# EAGLE design RNG01 (EAGLE 6.4)
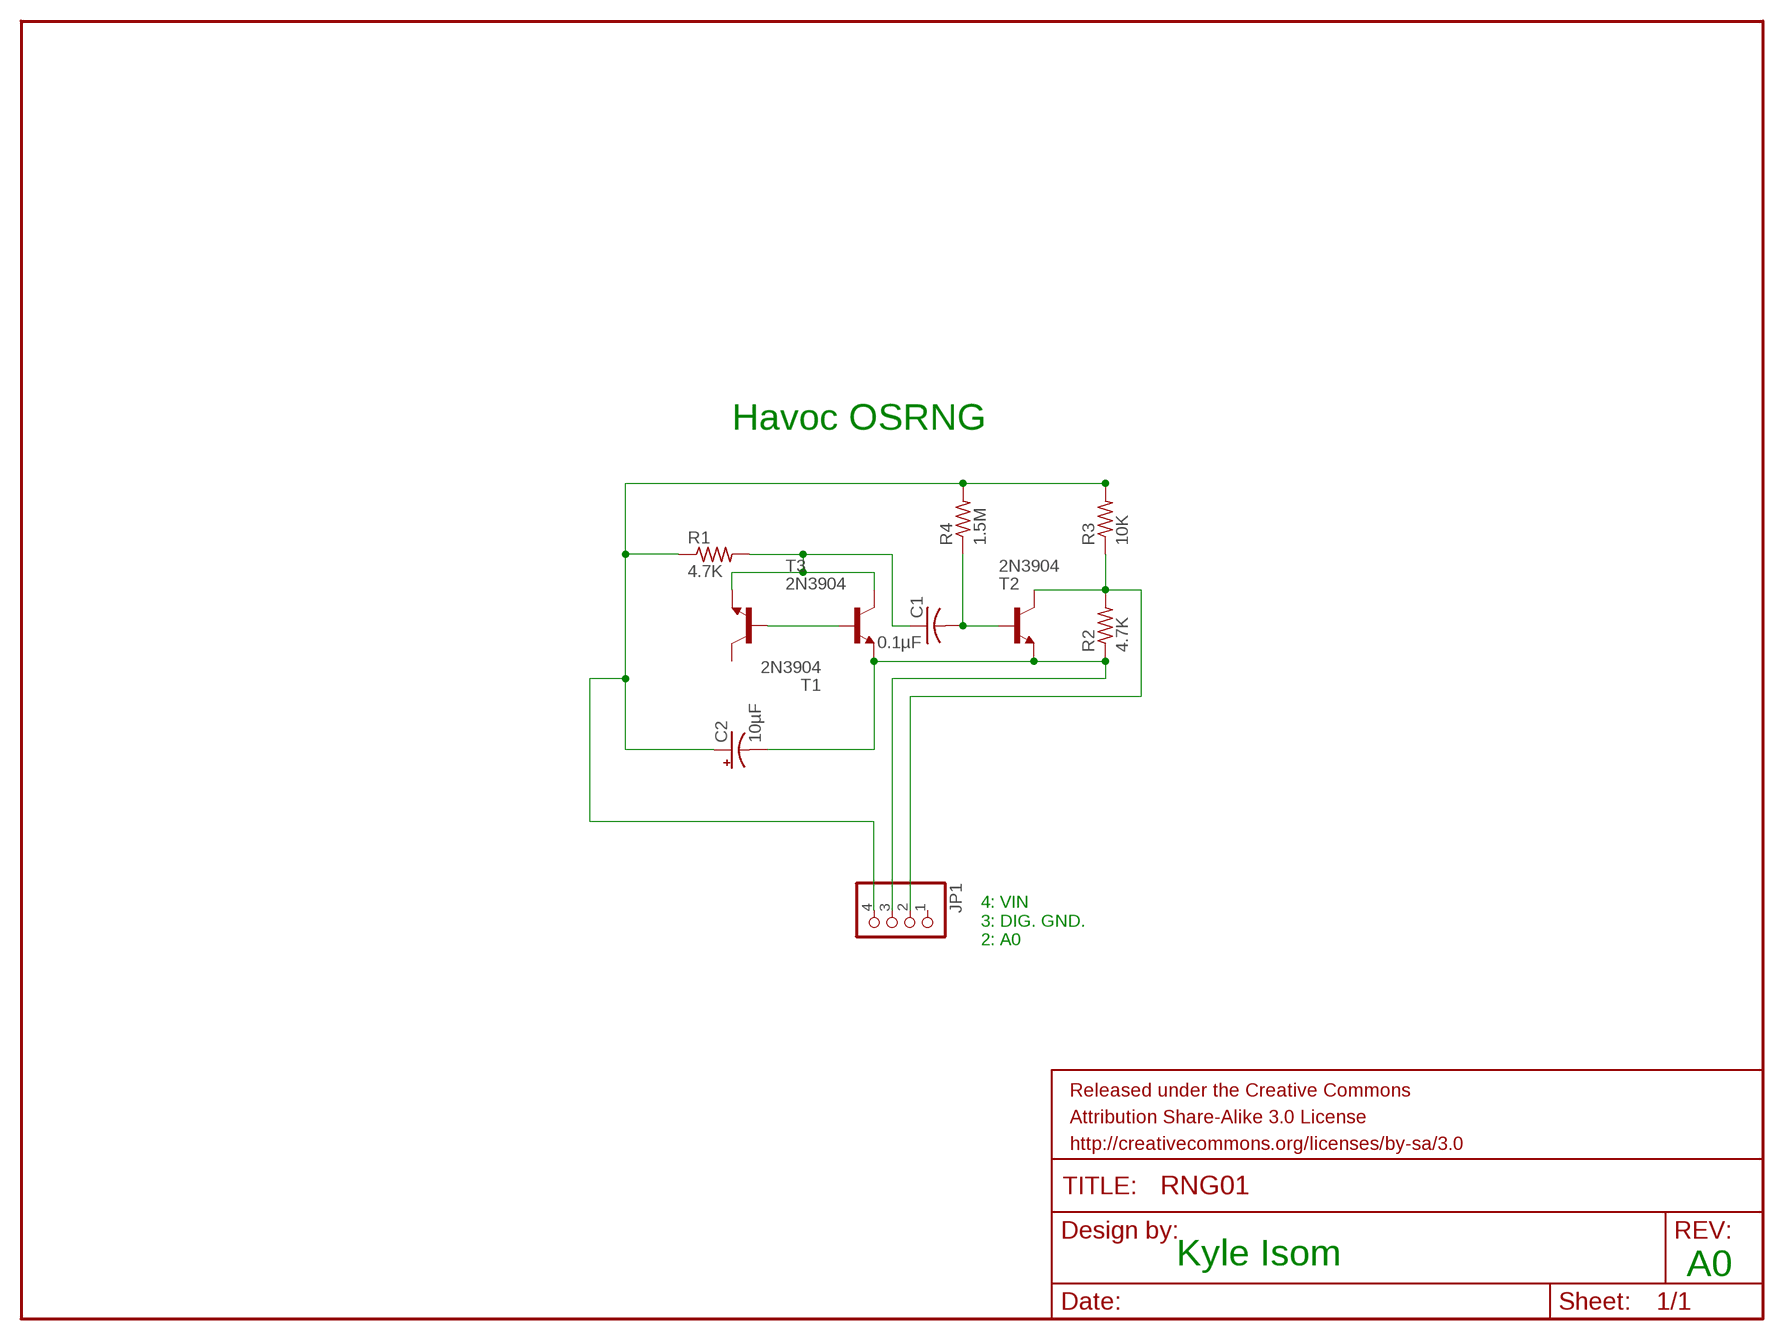
[diagram p0: schematic, sheet 1]

## Parts
C1  0.1µF  C-US050-030X075  [C050-030X075]
C2  10µF  CPOL-USE2-5  [E2-5]
FRAME1  FRAME-LETTER  [CREATIVE_COMMONS]
JP1  PINHD-1X4  [1X04]
R1  4.7K  R-US_0207/7  [0207/7]
R2  4.7K  R-US_0207/7  [0207/7]
R3  10K  R-US_0207/7  [0207/7]
R4  1.5M  R-US_0207/7  [0207/7]
T1  2N3904  [TO92]
T2  2N3904  [TO92]
T3  2N3904  [TO92]

## Nets
N$1: T1.2(B) T3.2(B)
N$2: C1.1 R1.2 T1.3(E) T3.1(C)
N$3: JP1.2 R2.2 R3.1 T2.1(C)
N$4: C2.- JP1.3 R2.1 T2.3(E) T3.3(E)
N$5: C2.+ JP1.4 R1.1 R3.2 R4.2
N$7: C1.2 R4.1 T2.2(B)
Unconnected: JP1.1 T1.1(C)

## Notes on the sheet
- Havoc OSRNG
- 4: VIN
  3: DIG. GND.
  2: A0
- Kyle Isom
- A0

## Library data of the parts
C1 = resistor:C-US: CAPACITOR, American symbol
C2 = resistor:CPOL-US: POLARIZED CAPACITOR, American symbol
FRAME1 = SparkFun-Aesthetics:FRAME-LETTER: Schematic Frame Standard 8.5x11 US Letter frame
JP1 = pinhead:PINHD-1X4: PIN HEADER
R1-R4 = resistor:R-US_: RESISTOR, American symbol
T1-T3 = transistor:2N3904: NPN TRANSISTOR

## Board
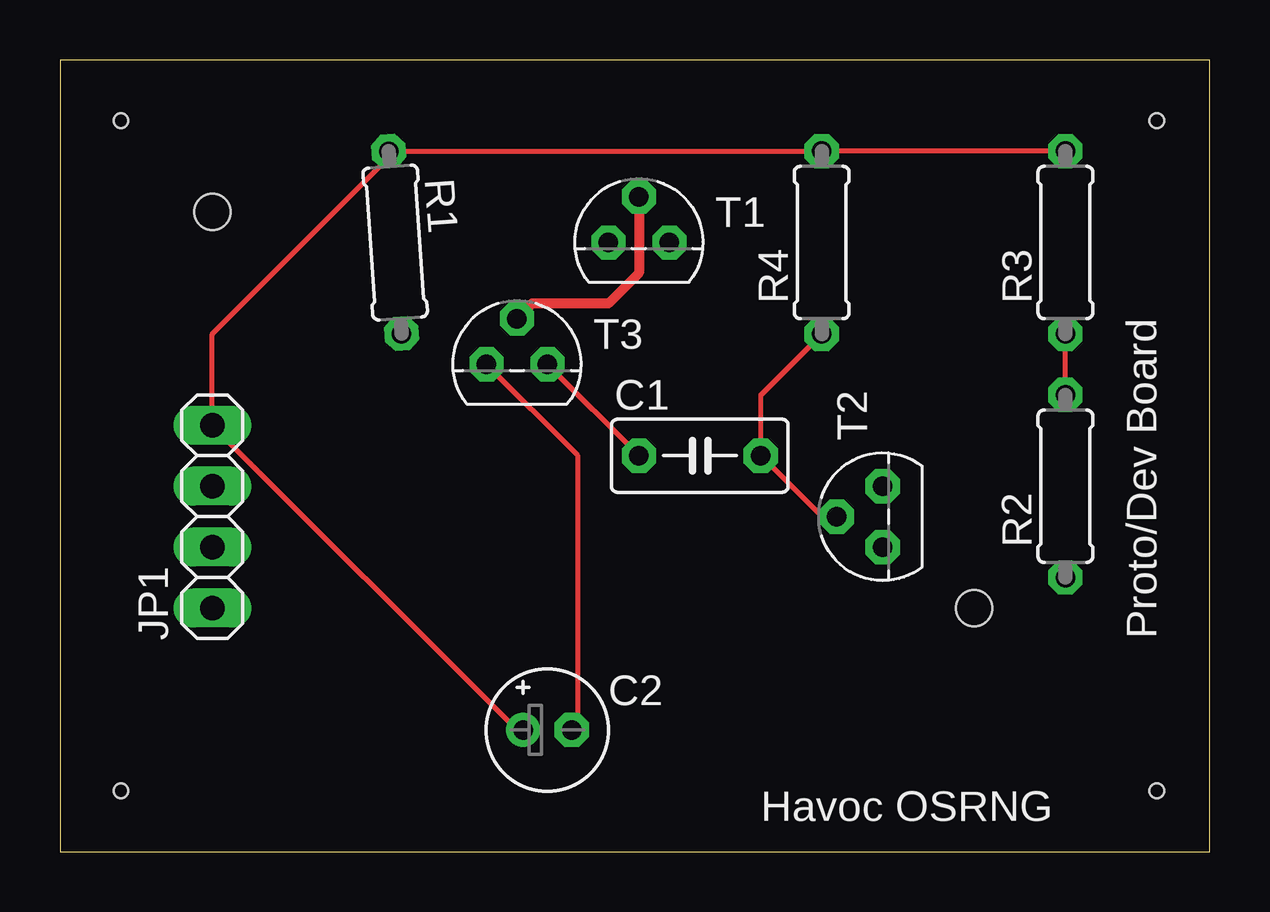
[diagram p1: board, top side]
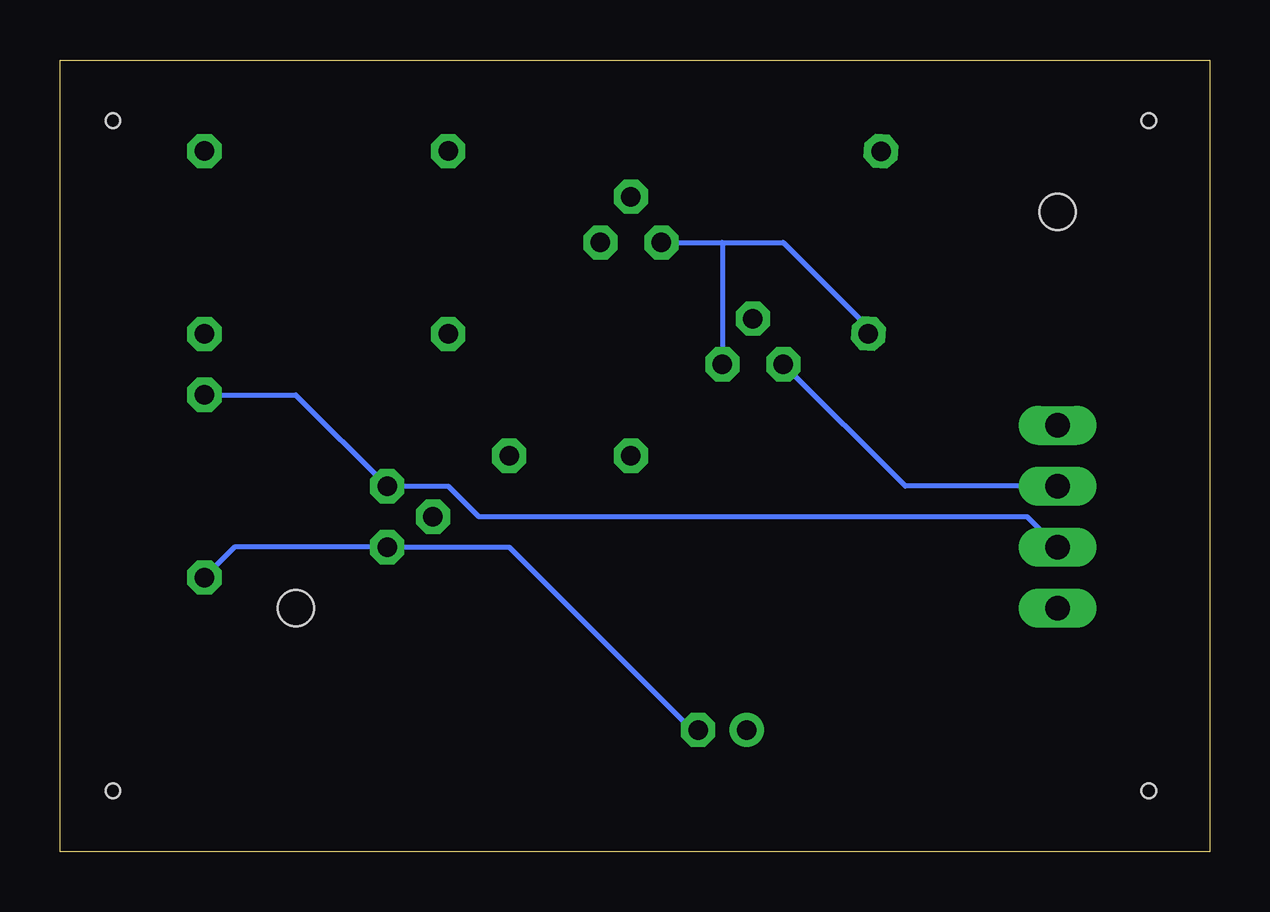
[diagram p2: board, bottom side, seen from below]

Size 47.93 x 33.01 mm. Coordinates in mm from the lower left corner, seen from the top.
Outline: 0,0 47.93,0 47.93,33.01 0,33.01 0,0
Copper layers (1*16): Top 0.035mm / dielectric 1.5mm / Bottom 0.035mm
Design rules "SparkFun": minimum track width 8mil, minimum drill 20mil, track to track 8mil, track to pad 8mil, pad to pad 8mil, via to via 8mil, smd to smd 8mil, copper to edge 10mil, drill to drill 8mil, minimum pad ring 12mil, minimum via ring 10mil, stop-mask expansion 4mil, vias tented up to drill 25mil, thermal gap 10mil
Holes 0.6 mm at 2.54,30.48 2.54,2.54 45.72,2.54 45.72,30.48
Holes 1.5 mm at 6.35,26.67 38.1,10.16

### Footprints (pad centres in the part's own frame; a part is rotated, then mirrored left to right if it is on the bottom)
C050-030X075 = drill 0.813 octagon: 1 -2.54,0; 2 2.54,0
E2-5 = drill 0.813 pad 1.27: + -1.016,0 | drill 0.813 pad 1.27 octagon: - 1.016,0
1X04 = drill 1.016 long: 1 -3.81,0; 2 -1.27,0; 3 1.27,0; 4 3.81,0
0207/7 = drill 0.813 octagon: 1 -3.81,0; 2 3.81,0
TO92 = drill 0.813 octagon: 1 1.27,0; 2 0,1.905; 3 -1.27,0

### Placement (x,y rotation side)
C1  26.67,16.51 0 top
C2  20.32,5.08 0 top
FRAME1  0,-13.97 0 top  (outside the outline)
JP1  6.35,13.97 90 top
R1  13.97,25.4 274 top
R2  41.91,15.24 90 top
R3  41.91,25.4 90 top
R4  31.75,25.4 90 top
T1  24.13,25.4 0 top
T2  34.29,13.97 90 top
T3  19.05,20.32 0 top

### Tracks (layer width: path | path; a pad name or v marks a point on that pad's centre or on a via)
N$1
  Top 0.406: T1.2 24.13,24.13 22.86,22.86 19.68,22.86 T3.2
N$2
  Top 0.203: T3.1 C1.1
  Bottom 0.203: T1.3 20.32,25.4 | 20.32,25.4 17.78,25.4 13.97,21.59 R1.2 | 20.32,25.4 T3.1
N$3
  Top 0.203: R2.2 R3.1
  Bottom 0.203: R2.2 38.1,19.05 T2.1 31.75,15.24 30.48,13.97 7.62,13.97 JP1.2
N$4
  Top 0.203: T3.3 21.59,16.51 21.59,5.08 C2.-
  Bottom 0.203: T3.3 12.7,15.24 JP1.3 | C2.- 21.59,5.08 29.21,12.7 T2.3 40.64,12.7 R2.1
N$5
  Top 0.203: R3.2 R4.2 13.97,29.21 | C2.+ 19.05,5.08 JP1.4 6.35,21.59 13.97,29.21 | 13.97,29.21 R1.1
N$7
  Top 0.203: T2.2 31.75,13.97 C1.2 29.21,19.05 R4.1

### Text on the board
tPlace: Proto/Dev Board | Havoc OSRNG